# EAGLE schematic mspBOT board (EAGLE 6.6.0)
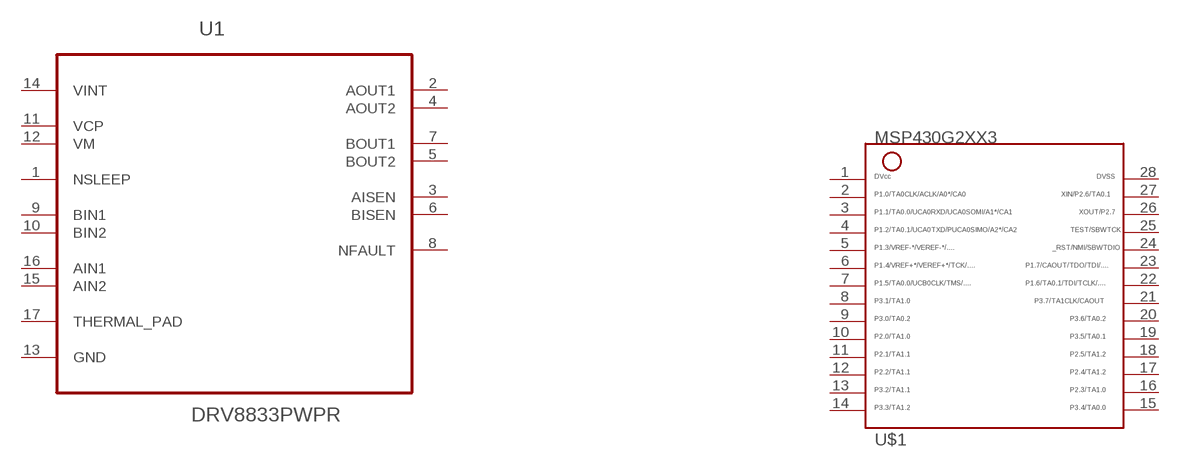
[diagram p0: schematic, sheet 1]

## Parts
U1  DRV8833PWPR  [SOP65P640X120-17N]
U$1  G2XX3---PW28  [PW28]
Unconnected: U1.1(NSLEEP) U1.2(AOUT1) U1.3(AISEN) U1.4(AOUT2) U1.5(BOUT2) U1.6(BISEN) U1.7(BOUT1) U1.8(NFAULT) U1.9(BIN1) U1.10(BIN2) U1.11(VCP) U1.13(GND) U1.15(AIN2) U1.16(AIN1) U1.17(THERMAL_PAD) U$1.1 U$1.2 U$1.3 U$1.4 U$1.5 U$1.6 U$1.7 U$1.8 U$1.9 U$1.10 U$1.11 U$1.12 U$1.13 U$1.14 U$1.15 U$1.16 U$1.17 U$1.18 U$1.19 U$1.20 U$1.21 U$1.22 U$1.23 U$1.24 U$1.25 U$1.26 U$1.27 U$1.28

## Power pins joined to a net without a drawn wire
VINT: U1.14(VINT)
VM: U1.12(VM)

## Library data of the parts
U1 = DRV8833PWPR:DRV8833PWPR: DUAL H-BRIDGE MOTOR DRIVER,HTSSOP -16; MPN: DRV8833PWPR; OC_FARNELL: 2057085; OC_NEWARK: 64T2941; PACKAGE: HTSSOP -16; SUPPLIER: TEXAS INSTRUMENTS
U$1 = TI_MSP430_v16:G2XX3---PW28: MSP430G2XX1 TSSOP (PW) 28 Pin Package